# EAGLE schematic hand-held-controller (EAGLE 6.4)
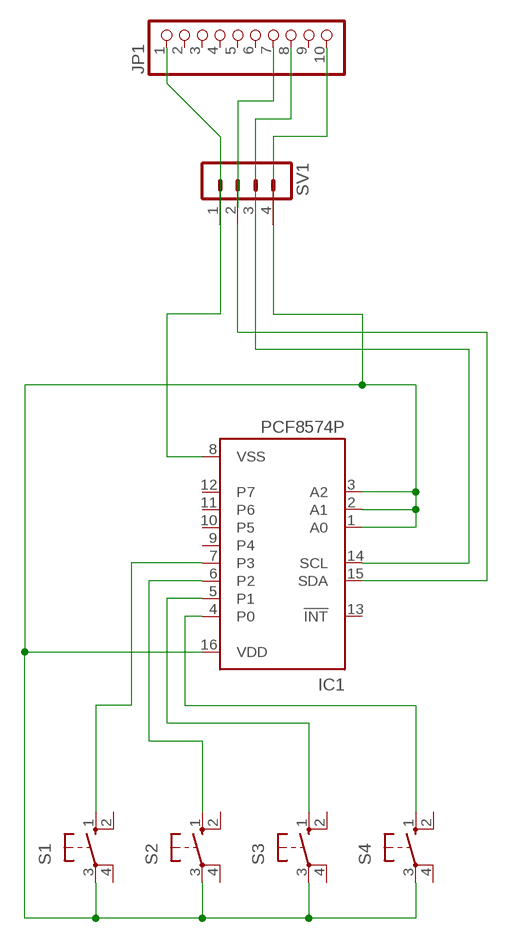
[diagram p0: schematic, sheet 1]

## Parts
IC1  PCF8574P  [DIL16]
JP1  PINHD-1X10  [1X10]
S1  10-XX  [B3F-10XX]
S2  10-XX  [B3F-10XX]
S3  10-XX  [B3F-10XX]
S4  10-XX  [B3F-10XX]
SV1  MA04-1  [MA04-1]

## Nets
N$1: IC1.1(A0) IC1.2(A1) IC1.3(A2) IC1.16(VDD) JP1.10 S1.3(P) S2.3(P) S3.3(P) S4.3(P) SV1.4
N$2: IC1.8(VSS) JP1.1 SV1.1
N$3: IC1.14(SCL) JP1.8 SV1.3
N$4: IC1.15(SDA) SV1.2
N$5: IC1.4(P0) S4.1(S)
N$6: IC1.5(P1) S3.1(S)
N$7: IC1.6(P2) S2.1(S)
N$8: IC1.7(P3) S1.1(S)
N$9: JP1.7
Unconnected: IC1.9(P4) IC1.10(P5) IC1.11(P6) IC1.12(P7) IC1.13(!INT) JP1.2 JP1.3 JP1.4 JP1.5 JP1.6 JP1.9 S1.2(S1) S1.4(P1) S2.2(S1) S2.4(P1) S3.2(S1) S3.4(P1) S4.2(S1) S4.4(P1)

## Library data of the parts
IC1 = micro-philips:PCF8574: I2C-Bus Remote 8-bit I/O expander http://www.semiconductors.philips.com/acrobat_download/datasheets/PCF8574_4.pdf; MPN: PCF8574PN; OC_FARNELL: 204020; OC_NEWARK: 11N8515
JP1 = pinhead:PINHD-1X10: PIN HEADER
S1-S4 = switch-omron:10-XX: OMRON SWITCH; MPN: B3F-1000; OC_FARNELL: 176432; OC_NEWARK: 36M3542
SV1 = con-lstb:MA04-1: PIN HEADER; OC_FARNELL: unknown; OC_NEWARK: unknown